# Altium schematic sheet Isolator_I2C.SchDoc
size A4; SheetNumber: 15; SheetTotal: 16
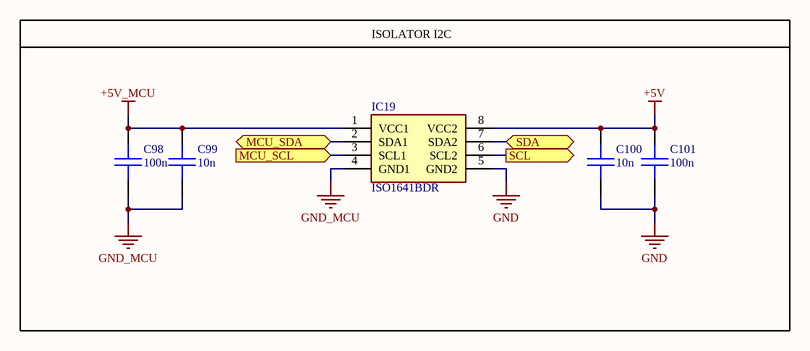
[diagram p0: Isolator_I2C.SchDoc]

## Parts
C98  100n  [C_0603]
C99  10n  [C_0603]
C100  10n  [C_0603]
C101  100n  [C_0603]
IC19  ISO1641BDR  [SOIC127P600X175-8N]

## Blocks framed on the sheet
ISOLATOR I2C: C98-C101 IC19

## Ports
MCU_SCL (in, see Interconnections[5A], Microcontroller[4A]), MCU_SDA (bidir, see Interconnections[5A], Microcontroller[4A]), SCL (out, see Interconnections[4A], Eeprom[1A], IO_Expander[2A]), SDA (bidir, see Interconnections[4A], Eeprom[1A], IO_Expander[2A])

## Nets
+5V: C100.2 C101.2 IC19.8(VCC2)
+5V_MCU: C98.2 C99.2 IC19.1(VCC1)
GND: C100.1 C101.1 IC19.5(GND2)
GND_MCU: C98.1 C99.1 IC19.4(GND1)
MCU_SCL: IC19.3(SCL1) ; port MCU_SCL
MCU_SDA: IC19.2(SDA1) ; port MCU_SDA
SCL: IC19.6(SCL2) ; port SCL
SDA: IC19.7(SDA2) ; port SDA

## Library data of the parts
C98-C101 = CAP: SMD Chip Capacitor
IC19 = ISO1641BDR: Integrated Circuit; Manufacturer_Name: Texas Instruments; Datasheet Link: https://www.ti.com/lit/ds/symlink/iso1641.pdf?ts=1621351593430&ref_url=https%253A%252F%252Fwww.ti.com%252Fisolation%252Fisolated-interfaces%252Fi2c%252Fproducts.html; Height: 1.75mm; Manufacturer_Part_Number: ISO1641BDR; Mouser Part Number: 595-ISO1641BDR; Mouser Price/Stock: https://www.mouser.co.uk/ProductDetail/Texas-Instruments/ISO1641BDR?qs=TuK3vfAjtkURaauWK%2F5e2g%3D%3D